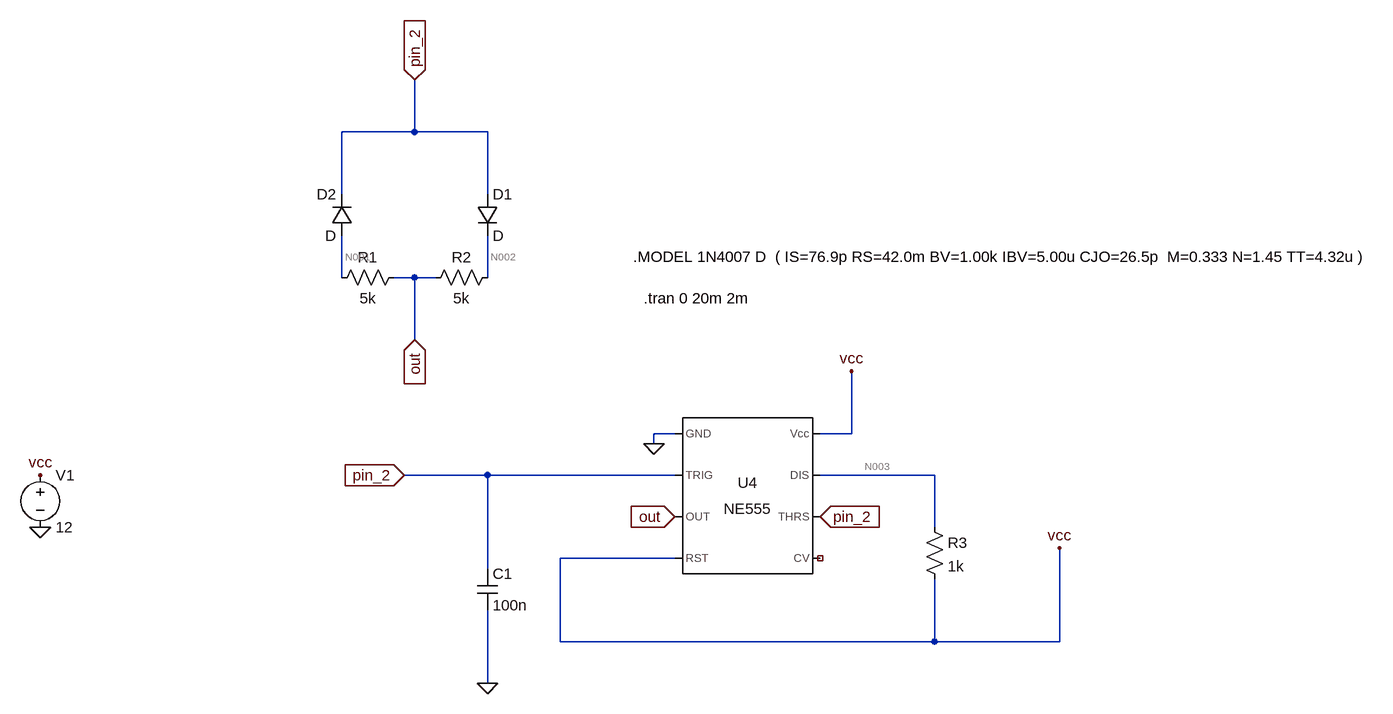
[diagram p0: schematic pwm.asc]
pwm.asc, the LTspice schematic file:
Version 4
SHEET 1 1000 680
WIRE -944 -240 -944 -320
WIRE -944 -240 -1056 -240
WIRE -832 -240 -944 -240
WIRE -1056 -144 -1056 -240
WIRE -832 -144 -832 -240
WIRE -1056 -16 -1056 -80
WIRE -944 -16 -976 -16
WIRE -912 -16 -944 -16
WIRE -832 -16 -832 -80
WIRE -944 80 -944 -16
WIRE -544 224 -576 224
WIRE -272 224 -272 128
WIRE -272 224 -320 224
WIRE -576 240 -576 224
WIRE -832 288 -960 288
WIRE -544 288 -832 288
WIRE -144 288 -320 288
WIRE -144 368 -144 288
WIRE -544 416 -720 416
WIRE -832 432 -832 288
WIRE -720 544 -720 416
WIRE -144 544 -144 448
WIRE -144 544 -720 544
WIRE 48 544 48 400
WIRE 48 544 -144 544
WIRE -832 608 -832 496
FLAG -1520 368 0
FLAG -1520 288 vcc
FLAG -272 128 vcc
FLAG -576 240 0
FLAG -944 -320 pin_2
IOPIN -944 -320 In
FLAG -320 352 pin_2
IOPIN -320 352 In
FLAG -544 352 out
IOPIN -544 352 In
FLAG -944 80 out
IOPIN -944 80 In
FLAG -960 288 pin_2
IOPIN -960 288 In
FLAG -832 608 0
FLAG 48 400 vcc
SYMBOL Misc\\NE555 -432 320 R0
SYMATTR InstName U4
SYMBOL voltage -1520 272 R0
WINDOW 123 0 0 Left 0
WINDOW 39 0 0 Left 0
SYMATTR InstName V1
SYMATTR Value 12
SYMBOL res -960 -32 R90
WINDOW 0 0 56 VBottom 2
WINDOW 3 32 56 VTop 2
SYMATTR InstName R1
SYMATTR Value 5k
SYMBOL res -816 -32 R90
WINDOW 0 0 56 VBottom 2
WINDOW 3 32 56 VTop 2
SYMATTR InstName R2
SYMATTR Value 5k
SYMBOL diode -848 -144 R0
SYMATTR InstName D1
SYMBOL diode -1040 -80 R180
WINDOW 0 24 64 Left 2
WINDOW 3 24 0 Left 2
SYMATTR InstName D2
SYMBOL res -160 352 R0
SYMATTR InstName R3
SYMATTR Value 1k
SYMBOL cap -848 432 R0
SYMATTR InstName C1
SYMATTR Value 100n
TEXT -592 16 Left 2 !.tran 0 20m 2m
TEXT -608 -48 Left 2 !.MODEL 1N4007 D  ( IS=76.9p RS=42.0m BV=1.00k IBV=5.00u CJO=26.5p  M=0.333 N=1.45 TT=4.32u )

The netlist it stands for:
* pwm.asc
XU4 0 pin_2 out vcc NC_01 pin_2 N003 vcc NE555  ; pins GND TRIG OUT RST CV THRS DIS Vcc
V1 vcc 0 12
R1 out N001 5k
R2 N002 out 5k
D1 pin_2 N002 D
D2 N001 pin_2 D
R3 N003 vcc 1k
C1 pin_2 0 100n
.model D D
.lib standard.dio
.tran 0 20m 2m
.MODEL 1N4007 D  ( IS=76.9p RS=42.0m BV=1.00k IBV=5.00u CJO=26.5p  M=0.333 N=1.45 TT=4.32u )
.lib NE555.sub
.backanno
.end

* Results of the author's LTspice run, read from the files saved beside the schematic
* Operating Point, zero values left out:
*   V(pin_2) = 11.62 V
*   V(vcc) = 12 V
*   V(n003) = 12 V
*   V(out) = 12 V
*   V(n001) = 12 V
*   V(n002) = 12 V
*   I(D2) = 23.24 nA
*   I(R3) = -16.01 nA
*   I(R1) = 23.24 nA
*   I(V1) = -3.881 mA
*   Ix(u4:1) = -3.881 mA
*   Ix(u4:2) = 11.62 nA
*   Ix(u4:3) = -23.24 nA
*   Ix(u4:4) = 69.33 µA
*   Ix(u4:6) = 11.62 nA
*   Ix(u4:7) = 16.01 nA
*   Ix(u4:8) = 3.812 mA
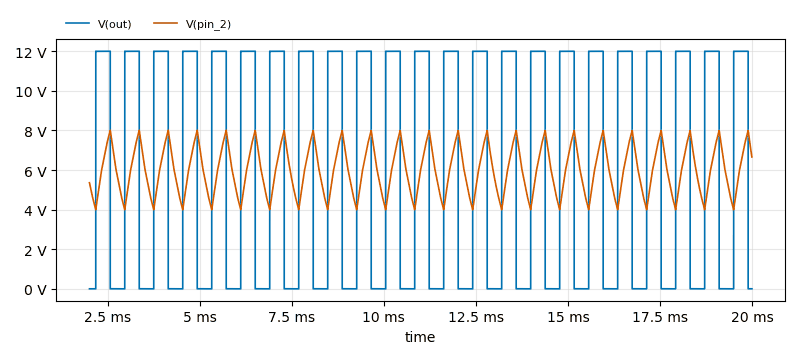
[diagram p1: Transient Analysis of pwm.asc, plotted from the saved traces]
* Transient Analysis, 1 run:
*   V(out): min 4.092 mV, max 12 V, average 6.041 V, rms 8.51 V, last 7.26 mV
*   V(pin_2): min 3.998 V, max 8.002 V, average 5.998 V, rms 6.144 V, last 6.657 V